# Altium schematic sheet 23D_OLEDisplay_test.SchDoc
size A4
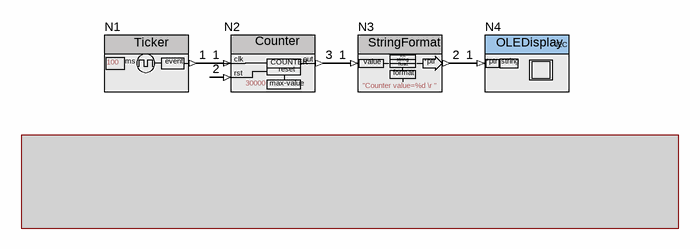
[diagram p0: 23D_OLEDisplay_test.SchDoc]

## Parts
N1  Ticker  nBlocksParameter1: 100
N2  Counter  nBlocksParameter1: 30000
N3  StringFormat  nBlocksParameter1: "Counter value=%d \r "
N4  OLEDisplay

## Nets
NetN1_1: N1.1(OUT) N2.1(COUNT-IN)
NetN2_3: N2.3(OUT) N3.1(IN)
NetN3_2: N3.2(OUT) N4.1(value)

Not connected (* = marked no-connect by the designer): N2 2(RESET)

## Notes on the sheet
- (in symbol NODE-COUNTER) clk; out; COUNTER; rst; reset; max-value
- (in symbol NODE-OLEDisplay) I2C; *ptr; string
- (in symbol NODE-STRINGFORMAT) int; string; value; float; *ptr; format
- (in symbol NODE-TICKER) ms; event

## Library data of the parts
N1 = NODE-TICKER: Creates a Periodical Event; ComponentLink1Description: link; ComponentLink1URL: https://github.com/nBlocksStudioNodes/nblocks_ticker
N2 = NODE-COUNTER: # Counter / This node is a Reset-able Counter. It increments a count every time the input is triggered and outputs the count value every time the frame updates. / Returns to zero, when max-value is reached / *  Category: Time / *  HAL: mbed / *  Tested: LPC1768, LPC1U35, STM32F103, STM32L432, STM32F401, nRF52832 / *  Author: Ian Aherne / ## Inputs/Outputs / *  (1) The 1st input is the Counter clock input, increments the counter. / *  (2) The 2nd input Resets the Generator / *  (3)The Output is the actual Counter value. / ## Parameters / *  uint32_t: auto_reset, Maximum Counter Value, when the counter reaches this value auto-resets / ## Example: / [Ticker][Counter][StringFormat][StringSerial] /; Parameter 1: AutoResetValue; ComponentLink1Description: link; ComponentLink1URL: https://github.com/nBlocksStudioNodes/nblocks_counter
N3 = NODE-STRINGFORMAT: # StringFormat / Adds Formatting to a number in printf style / *  Category: String / *  HAL: mbed / *  Tested: LPC1768, STM32F103, STM32F401, nRF52832 / *  Author: Fernando Cosentino / ## Inputs/Outputs / *  (1) Input int: Value in form of string, or int or float / *  (2) Output uint32_t: Pointer to array of string, or int, or float / ## Parameters / *  formatString: example "Value: %d\n" / ## Example: / [Ticker][Counter][StringFormat][StringSerial] / Prints / “Value: 0” / “Value: 1” / “Value: 3” / … /; ComponentLink1Description: link; ComponentLink1URL: https://github.com/nBlocksStudioNodes/nblocks_stringformat; Parameter 1: formatString
N4 = NODE-OLEDisplay: # LM75 / This node handles temperature readings from a LM75 sensor over I2C. / *  Category: Sensor / *  HAL: mbed / *  Tested: LPC1768 / *  Author: Fernando Cosentino / ## Inputs/Outputs / *  (1) Trigger: Starts a measurement conversion / *  (2) Celcius:  °C  Temperature in degrees Celcius / ## Parameters / *  PinName: Pin connected to the sensor's SDA line / *  PinName: Pin connected to the sensor's SCL line / *  int: I2C address / *  float: alarmMin, Lower threshold for temperature alarm / *  float: alarmMax, Upper threshold for temperature alarm / *  int: comparatorPolarity, output value for the OS output when active / *  int: scale: Scale Factor / *  Multiplier for temperature value as integer (scale=100 means 2.5C will be represented as 250) / ## Example: / [Ticker]-->[LM75]-->[StringFormat]-->[StringSerial] /; Parameter 2: pinSCL; Parameter 1: pinSDA; Parameter 3: pinRST; nBlocksParameter3: p27; nBlocksParameter2: p10; nBlocksParameter1: p9; ComponentLink1Description: link; ComponentLink1URL: https://github.com/nBlocksStudioNodes/nblocks_oledisplay